# Altium project ange显示键盘.PrjPcb
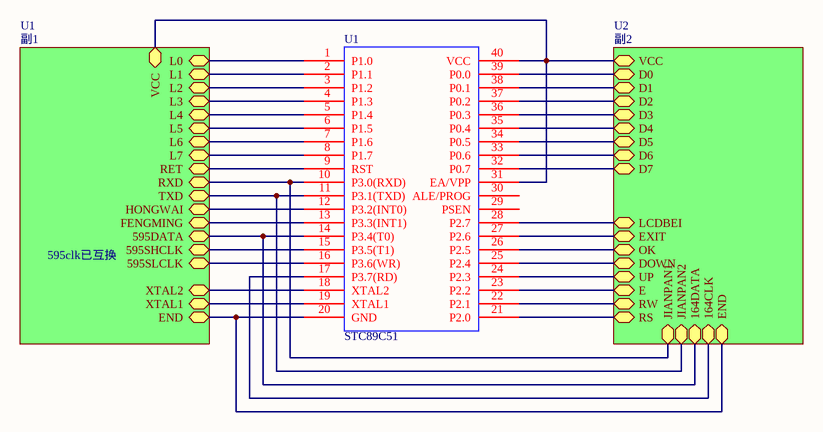
[diagram p0: 主图.SchDoc]
3 sheets, 121 parts. Net scope: hierarchical (ports join the sheet entries above them; power ports are global).
Board file: ANGE.PcbDoc
Sheets:
  主图.SchDoc
    U1 = 副1.SchDoc
    U2 = 副2.SchDoc

## Sheet 主图.SchDoc
size A4

### Parts
U1  STC89C51  [DIP_40]

### Sub-sheets
U1 = 副1: RET, RXD, TXD, HONGWAI, FENGMING, 595DATA, 595SHCLK, 595SLCLK, XTAL2, XTAL1, END, L0, L1, L2, L3, L4, L5, L6, L7, VCC
U2 = 副2: VCC, D0, D1, D2, D3, D4, D5, D6, D7, LCDBEI, EXIT, OK, DOWN, UP, E, RW, RS, JIANPAN1, JIANPAN2, 164DATA, 164CLK, END

### Nets
595SHCLK: U1.16(P3.6(WR)) ; sheet U1/595SLCLK
595SLCLK: U1.15(P3.5(T1)) ; sheet U1/595SHCLK
END: U1.20(GND) ; sheet U1/END, sheet U2/END
VCC: U1.31(EA/VPP) U1.40(VCC) ; sheet U1/VCC, sheet U2/VCC
NetC1_1: U1.18(XTAL2) ; sheet U1/XTAL2
NetC2_1: U1.19(XTAL1) ; sheet U1/XTAL1
NetC4_2: U1.9(RST) ; sheet U1/RET
NetHC1_14: U1.14(P3.4(T0)) ; sheet U1/595DATA, sheet U2/164DATA
NetHC7_8: U1.17(P3.7(RD)) ; sheet U2/164CLK
NetK3_1: U1.27(P2.6) ; sheet U2/EXIT
NetK4_1: U1.24(P2.3) ; sheet U2/UP
NetK5_1: U1.25(P2.4) ; sheet U2/DOWN
NetK6_1: U1.26(P2.5) ; sheet U2/OK
NetK7_1: U1.10(P3.0(RXD)) ; sheet U1/RXD, sheet U2/JIANPAN1
NetK8_1: U1.11(P3.1(TXD)) ; sheet U1/TXD, sheet U2/JIANPAN2
NetR3_1: U1.13(P3.3(INT1)) ; sheet U1/FENGMING
NetR44_1: U1.8(P1.7) ; sheet U1/L7
NetR45_1: U1.7(P1.6) ; sheet U1/L6
NetR46_1: U1.6(P1.5) ; sheet U1/L5
NetR47_1: U1.5(P1.4) ; sheet U1/L4
NetR48_1: U1.4(P1.3) ; sheet U1/L3
NetR49_1: U1.3(P1.2) ; sheet U1/L2
NetR58_1: U1.2(P1.1) ; sheet U1/L1
NetR59_1: U1.1(P1.0) ; sheet U1/L0
NetR60_1: U1.28(P2.7) ; sheet U2/LCDBEI
NetRP1_2: U1.39(P0.0) ; sheet U2/D0
NetRP1_3: U1.38(P0.1) ; sheet U2/D1
NetRP1_4: U1.37(P0.2) ; sheet U2/D2
NetRP1_5: U1.36(P0.3) ; sheet U2/D3
NetRP1_6: U1.35(P0.4) ; sheet U2/D4
NetRP1_7: U1.34(P0.5) ; sheet U2/D5
NetRP1_8: U1.33(P0.6) ; sheet U2/D6
NetRP1_9: U1.32(P0.7) ; sheet U2/D7
NetS1_3: U1.12(P3.2(INT0)) ; sheet U1/HONGWAI
NetU1_21: U1.21(P2.0) ; sheet U2/RS
NetU1_22: U1.22(P2.1) ; sheet U2/RW
NetU1_23: U1.23(P2.2) ; sheet U2/E

Not connected (* = marked no-connect by the designer): U1 29(PSEN) 30(ALE/PROG)

### Notes on the sheet
- 595clk已互换

## Sheet 副1.SchDoc
size A3
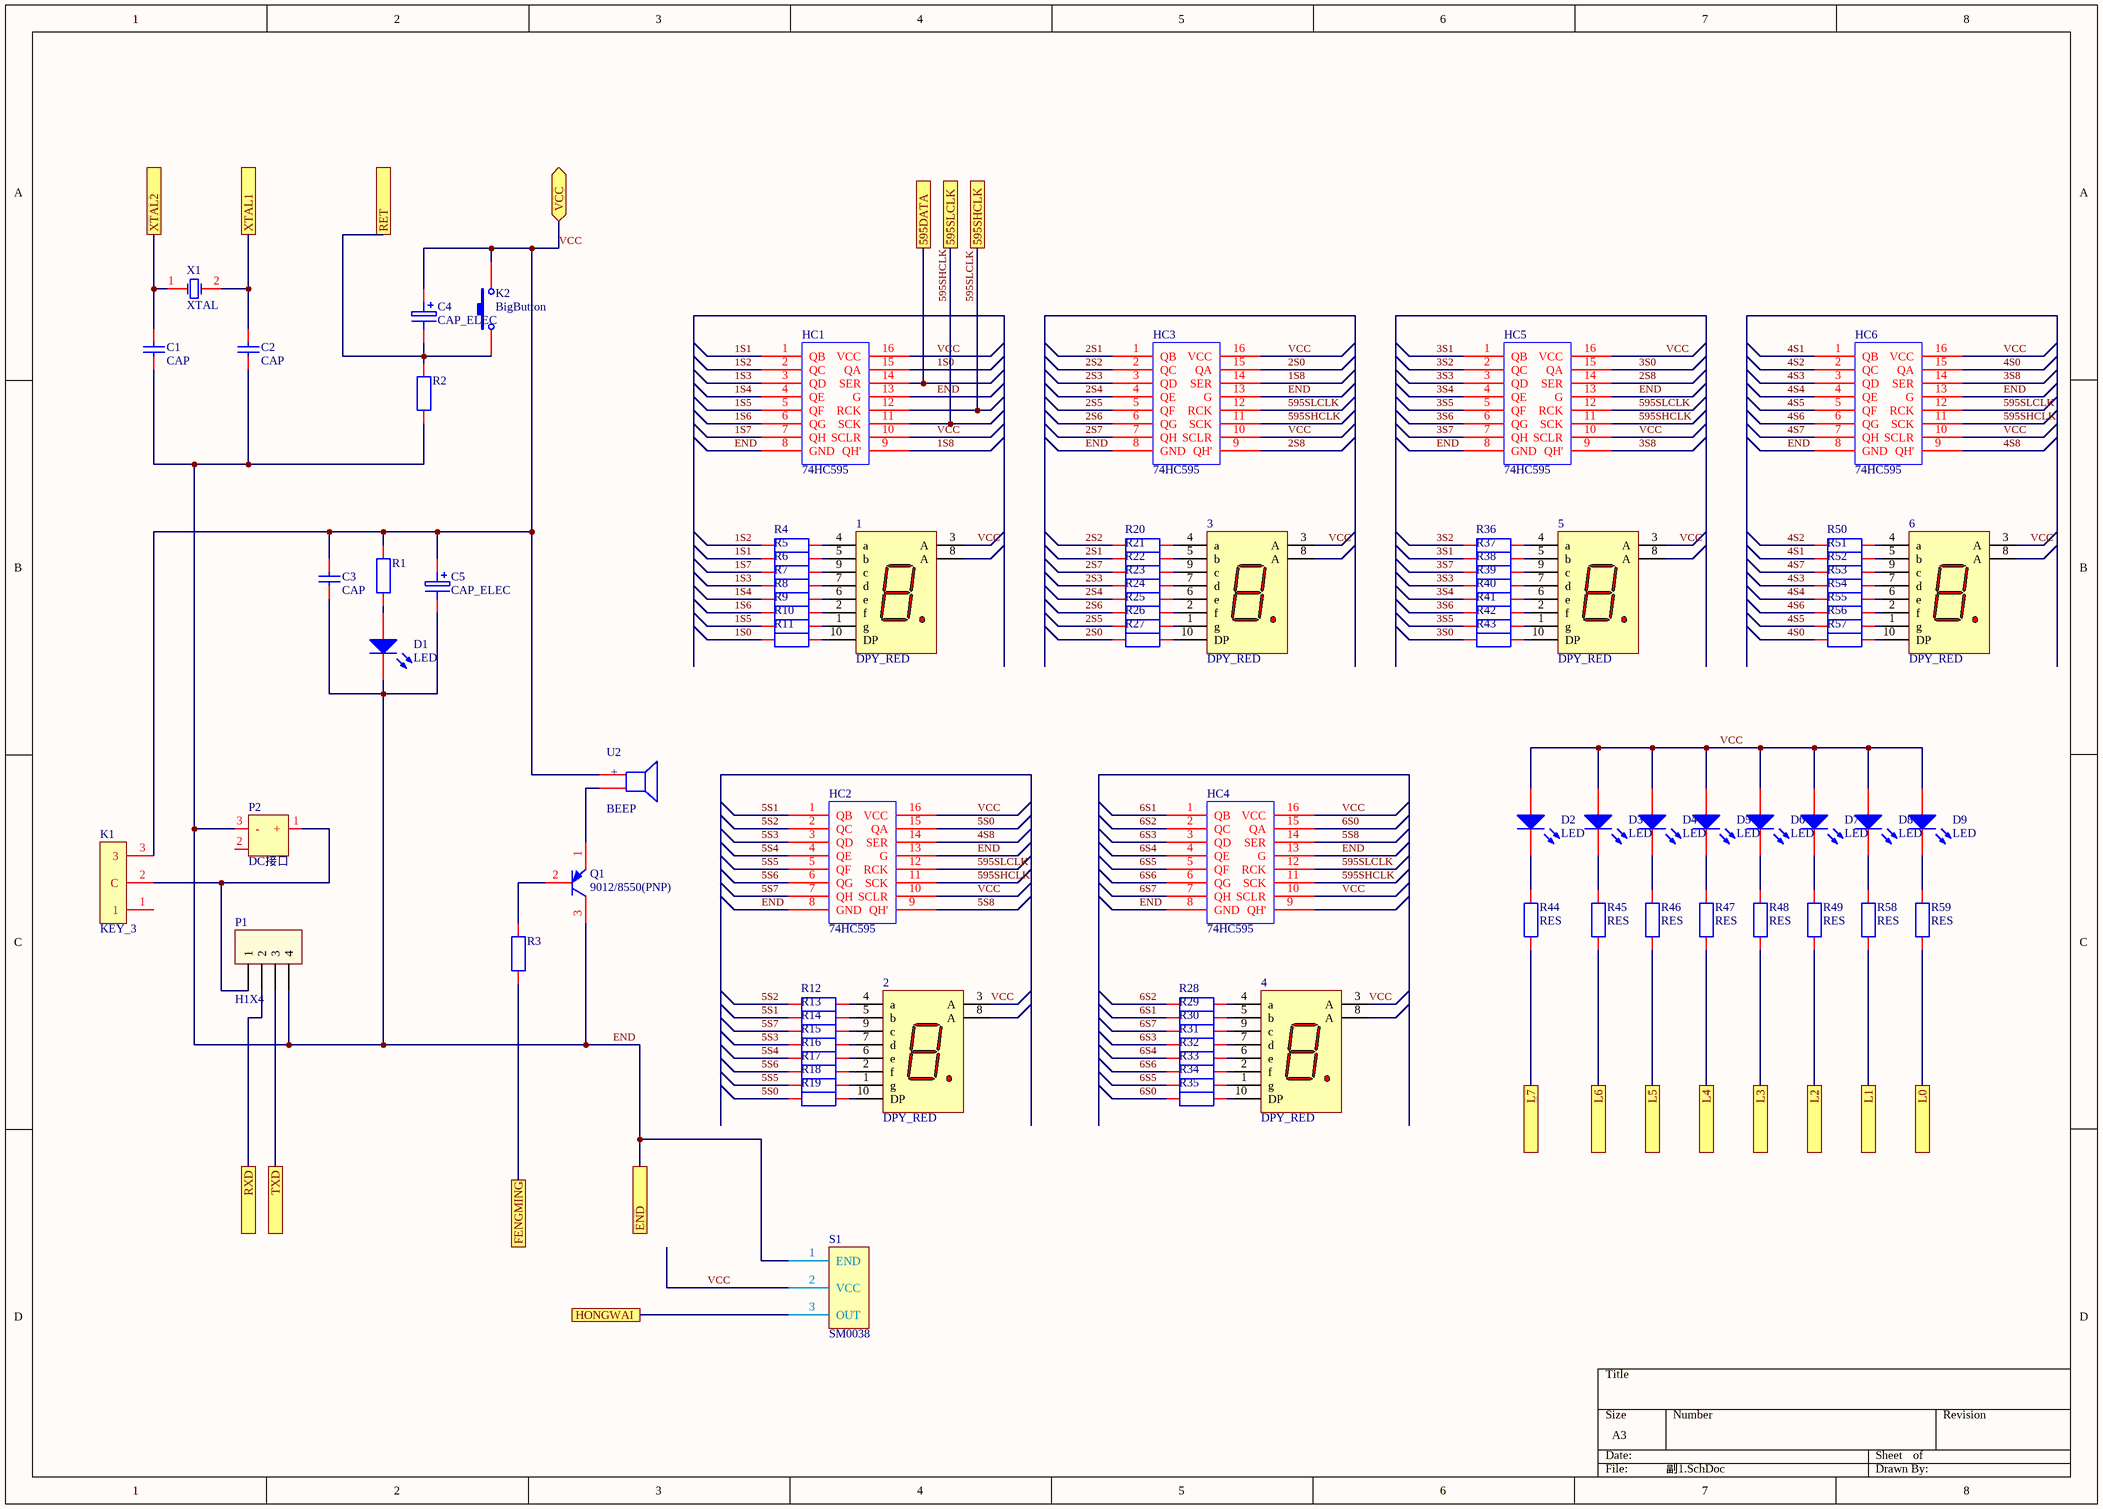
[diagram p1: 副1.SchDoc]

### Parts
1  DPY_RED  [7SEG_8]
2  DPY_RED  [7SEG_8]
3  DPY_RED  [7SEG_8]
4  DPY_RED  [7SEG_8]
5  DPY_RED  [7SEG_8]
6  DPY_RED  [7SEG_8]
C1  CAP  [Cap-Dip]
C2  CAP  [Cap-Dip]
C3  CAP  [Cap-Dip]
C4  CAP_ELEC  [CAP[25V]]
C5  CAP_ELEC  [CAP[16V]]
D1  LED  [LED]
D2  LED  [LED]
D3  LED  [LED]
D4  LED  [LED]
D5  LED  [LED]
D6  LED  [LED]
D7  LED  [LED]
D8  LED  [LED]
D9  LED  [LED]
HC1  74HC595  [DIP_16]
HC2  74HC595  [DIP_16]
HC3  74HC595  [DIP_16]
HC4  74HC595  [DIP_16]
HC5  74HC595  [DIP_16]
HC6  74HC595  [DIP_16]
K1  KEY_3  [KEY_3]
K2  BigButton  [BigButton]
P1  H1X4  [H2.54_1X4]
P2  DC接口  [DC接口]
Q1  9012/8550(PNP)  [TO_92]
R1  RES  [RES_DIP]  (value not drawn)
R2  RES  [RES_DIP]  (value not drawn)
R3  RES  [RES_DIP]  (value not drawn)
R4  RES  [RES_DIP]  (value not drawn)
R5  RES  [RES_DIP]  (value not drawn)
R6  RES  [RES_DIP]  (value not drawn)
R7  RES  [RES_DIP]  (value not drawn)
R8  RES  [RES_DIP]  (value not drawn)
R9  RES  [RES_DIP]  (value not drawn)
R10  RES  [RES_DIP]  (value not drawn)
R11  RES  [RES_DIP]  (value not drawn)
R12  RES  [RES_DIP]  (value not drawn)
R13  RES  [RES_DIP]  (value not drawn)
R14  RES  [RES_DIP]  (value not drawn)
R15  RES  [RES_DIP]  (value not drawn)
R16  RES  [RES_DIP]  (value not drawn)
R17  RES  [RES_DIP]  (value not drawn)
R18  RES  [RES_DIP]  (value not drawn)
R19  RES  [RES_DIP]  (value not drawn)
R20  RES  [RES_DIP]  (value not drawn)
R21  RES  [RES_DIP]  (value not drawn)
R22  RES  [RES_DIP]  (value not drawn)
R23  RES  [RES_DIP]  (value not drawn)
R24  RES  [RES_DIP]  (value not drawn)
R25  RES  [RES_DIP]  (value not drawn)
R26  RES  [RES_DIP]  (value not drawn)
R27  RES  [RES_DIP]  (value not drawn)
R28  RES  [RES_DIP]  (value not drawn)
R29  RES  [RES_DIP]  (value not drawn)
R30  RES  [RES_DIP]  (value not drawn)
R31  RES  [RES_DIP]  (value not drawn)
R32  RES  [RES_DIP]  (value not drawn)
R33  RES  [RES_DIP]  (value not drawn)
R34  RES  [RES_DIP]  (value not drawn)
R35  RES  [RES_DIP]  (value not drawn)
R36  RES  [RES_DIP]  (value not drawn)
R37  RES  [RES_DIP]  (value not drawn)
R38  RES  [RES_DIP]  (value not drawn)
R39  RES  [RES_DIP]  (value not drawn)
R40  RES  [RES_DIP]  (value not drawn)
R41  RES  [RES_DIP]  (value not drawn)
R42  RES  [RES_DIP]  (value not drawn)
R43  RES  [RES_DIP]  (value not drawn)
R44  RES  [RES_DIP]
R45  RES  [RES_DIP]
R46  RES  [RES_DIP]
R47  RES  [RES_DIP]
R48  RES  [RES_DIP]
R49  RES  [RES_DIP]
R50  RES  [RES_DIP]  (value not drawn)
R51  RES  [RES_DIP]  (value not drawn)
R52  RES  [RES_DIP]  (value not drawn)
R53  RES  [RES_DIP]  (value not drawn)
R54  RES  [RES_DIP]  (value not drawn)
R55  RES  [RES_DIP]  (value not drawn)
R56  RES  [RES_DIP]  (value not drawn)
R57  RES  [RES_DIP]  (value not drawn)
R58  RES  [RES_DIP]
R59  RES  [RES_DIP]
S1  SM0038  [SM0038]
U2  BEEP  [BEEP]
X1  XTAL  [XTAL_DIP]

### Ports
595DATA, 595SHCLK, 595SLCLK, END, FENGMING, HONGWAI, L0, L1, L2, L3, L4, L5, L6, L7, RET, RXD, TXD, VCC, XTAL1, XTAL2

### Nets
1S0: HC1.15(QA) R11.1
1S1: HC1.1(QB) R5.1
1S2: HC1.2(QC) R4.1
1S3: HC1.3(QD) R7.1
1S4: HC1.4(QE) R8.1
1S5: HC1.5(QF) R10.1
1S6: HC1.6(QG) R9.1
1S7: HC1.7(QH) R6.1
1S8: HC1.9(QH') HC3.14(SER)
2S0: HC3.15(QA) R27.1
2S1: HC3.1(QB) R21.1
2S2: HC3.2(QC) R20.1
2S3: HC3.3(QD) R23.1
2S4: HC3.4(QE) R24.1
2S5: HC3.5(QF) R26.1
2S6: HC3.6(QG) R25.1
2S7: HC3.7(QH) R22.1
2S8: HC3.9(QH') HC5.14(SER)
3S0: HC5.15(QA) R43.1
3S1: HC5.1(QB) R37.1
3S2: HC5.2(QC) R36.1
3S3: HC5.3(QD) R39.1
3S4: HC5.4(QE) R40.1
3S5: HC5.5(QF) R42.1
3S6: HC5.6(QG) R41.1
3S7: HC5.7(QH) R38.1
3S8: HC5.9(QH') HC6.14(SER)
4S0: HC6.15(QA) R57.1
4S1: HC6.1(QB) R51.1
4S2: HC6.2(QC) R50.1
4S3: HC6.3(QD) R53.1
4S4: HC6.4(QE) R54.1
4S5: HC6.5(QF) R56.1
4S6: HC6.6(QG) R55.1
4S7: HC6.7(QH) R52.1
4S8: HC2.14(SER) HC6.9(QH')
5S0: HC2.15(QA) R19.1
5S1: HC2.1(QB) R13.1
5S2: HC2.2(QC) R12.1
5S3: HC2.3(QD) R15.1
5S4: HC2.4(QE) R16.1
5S5: HC2.5(QF) R18.1
5S6: HC2.6(QG) R17.1
5S7: HC2.7(QH) R14.1
5S8: HC2.9(QH') HC4.14(SER)
6S0: HC4.15(QA) R35.1
6S1: HC4.1(QB) R29.1
6S2: HC4.2(QC) R28.1
6S3: HC4.3(QD) R31.1
6S4: HC4.4(QE) R32.1
6S5: HC4.5(QF) R34.1
6S6: HC4.6(QG) R33.1
6S7: HC4.7(QH) R30.1
595SHCLK: HC1.11(SCK) HC2.11(SCK) HC3.11(SCK) HC4.11(SCK) HC5.11(SCK) HC6.11(SCK) ; port 595SLCLK
595SLCLK: HC1.12(RCK) HC2.12(RCK) HC3.12(RCK) HC4.12(RCK) HC5.12(RCK) HC6.12(RCK) ; port 595SHCLK
END: C1.2 C2.2 C3.2 C5.2 D1.2(K) HC1.8(GND) HC1.13(G) HC2.8(GND) HC2.13(G) HC3.8(GND) HC3.13(G) HC4.8(GND) HC4.13(G) HC5.8(GND) HC5.13(G) HC6.8(GND) HC6.13(G) P1.4 P2.3(-) Q1.3(C) R2.1 S1.1(END) ; port END
VCC: 1.3(A) 2.3(A) 3.3(A) 4.3(A) 5.3(A) 6.3(A) C3.1 C4.1 C5.1 D2.1(A) D3.1(A) D4.1(A) D5.1(A) D6.1(A) D7.1(A) D8.1(A) D9.1(A) HC1.10(SCLR) HC1.16(VCC) HC2.10(SCLR) HC2.16(VCC) HC3.10(SCLR) HC3.16(VCC) HC4.10(SCLR) HC4.16(VCC) HC5.10(SCLR) HC5.16(VCC) HC6.10(SCLR) HC6.16(VCC) K1.3 K2.2 R1.2 S1.2(VCC) U2.1 ; port VCC
Net1_1: 1.1(g) R10.2
Net1_2: 1.2(f) R9.2
Net1_4: 1.4(a) R4.2
Net1_5: 1.5(b) R5.2
Net1_6: 1.6(e) R8.2
Net1_7: 1.7(d) R7.2
Net1_9: 1.9(c) R6.2
Net1_10: 1.10(DP) R11.2
Net2_1: 2.1(g) R18.2
Net2_2: 2.2(f) R17.2
Net2_4: 2.4(a) R12.2
Net2_5: 2.5(b) R13.2
Net2_6: 2.6(e) R16.2
Net2_7: 2.7(d) R15.2
Net2_9: 2.9(c) R14.2
Net2_10: 2.10(DP) R19.2
Net3_1: 3.1(g) R26.2
Net3_2: 3.2(f) R25.2
Net3_4: 3.4(a) R20.2
Net3_5: 3.5(b) R21.2
Net3_6: 3.6(e) R24.2
Net3_7: 3.7(d) R23.2
Net3_9: 3.9(c) R22.2
Net3_10: 3.10(DP) R27.2
Net4_1: 4.1(g) R34.2
Net4_2: 4.2(f) R33.2
Net4_4: 4.4(a) R28.2
Net4_5: 4.5(b) R29.2
Net4_6: 4.6(e) R32.2
Net4_7: 4.7(d) R31.2
Net4_9: 4.9(c) R30.2
Net4_10: 4.10(DP) R35.2
Net5_1: 5.1(g) R42.2
Net5_2: 5.2(f) R41.2
Net5_4: 5.4(a) R36.2
Net5_5: 5.5(b) R37.2
Net5_6: 5.6(e) R40.2
Net5_7: 5.7(d) R39.2
Net5_9: 5.9(c) R38.2
Net5_10: 5.10(DP) R43.2
Net6_1: 6.1(g) R56.2
Net6_2: 6.2(f) R55.2
Net6_4: 6.4(a) R50.2
Net6_5: 6.5(b) R51.2
Net6_6: 6.6(e) R54.2
Net6_7: 6.7(d) R53.2
Net6_9: 6.9(c) R52.2
Net6_10: 6.10(DP) R57.2
NetC1_1: C1.1 X1.1(OSC1) ; port XTAL2
NetC2_1: C2.1 X1.2(OSC2) ; port XTAL1
NetC4_2: C4.2 K2.1 R2.2 ; port RET
NetD1_1: D1.1(A) R1.1
NetD2_2: D2.2(K) R44.2
NetD3_2: D3.2(K) R45.2
NetD4_2: D4.2(K) R46.2
NetD5_2: D5.2(K) R47.2
NetD6_2: D6.2(K) R48.2
NetD7_2: D7.2(K) R49.2
NetD8_2: D8.2(K) R58.2
NetD9_2: D9.2(K) R59.2
NetHC1_14: HC1.14(SER) ; port 595DATA
NetK1_2: K1.2(C) P1.1 P2.1(+)
NetK7_1: P1.2 ; port RXD
NetK8_1: P1.3 ; port TXD
NetQ1_1: Q1.1(E) U2.2
NetQ1_2: Q1.2(B) R3.2
NetR3_1: R3.1 ; port FENGMING
NetR44_1: R44.1 ; port L7
NetR45_1: R45.1 ; port L6
NetR46_1: R46.1 ; port L5
NetR47_1: R47.1 ; port L4
NetR48_1: R48.1 ; port L3
NetR49_1: R49.1 ; port L2
NetR58_1: R58.1 ; port L1
NetR59_1: R59.1 ; port L0
NetS1_3: S1.3(OUT) ; port HONGWAI

Not connected (* = marked no-connect by the designer): 1 8(A); 2 8(A); 3 8(A); 4 8(A); 5 8(A); 6 8(A); HC4 9(QH'); K1 1; P2 2

### Notes on the sheet
- (in symbol BEEP) +

### Library data of the parts
K1 = KEY_3: 乒乓开关
P2 = DC接口: 电源接口
Q1 = 9012/8550(PNP): PNP

## Sheet 副2.SchDoc
size A3
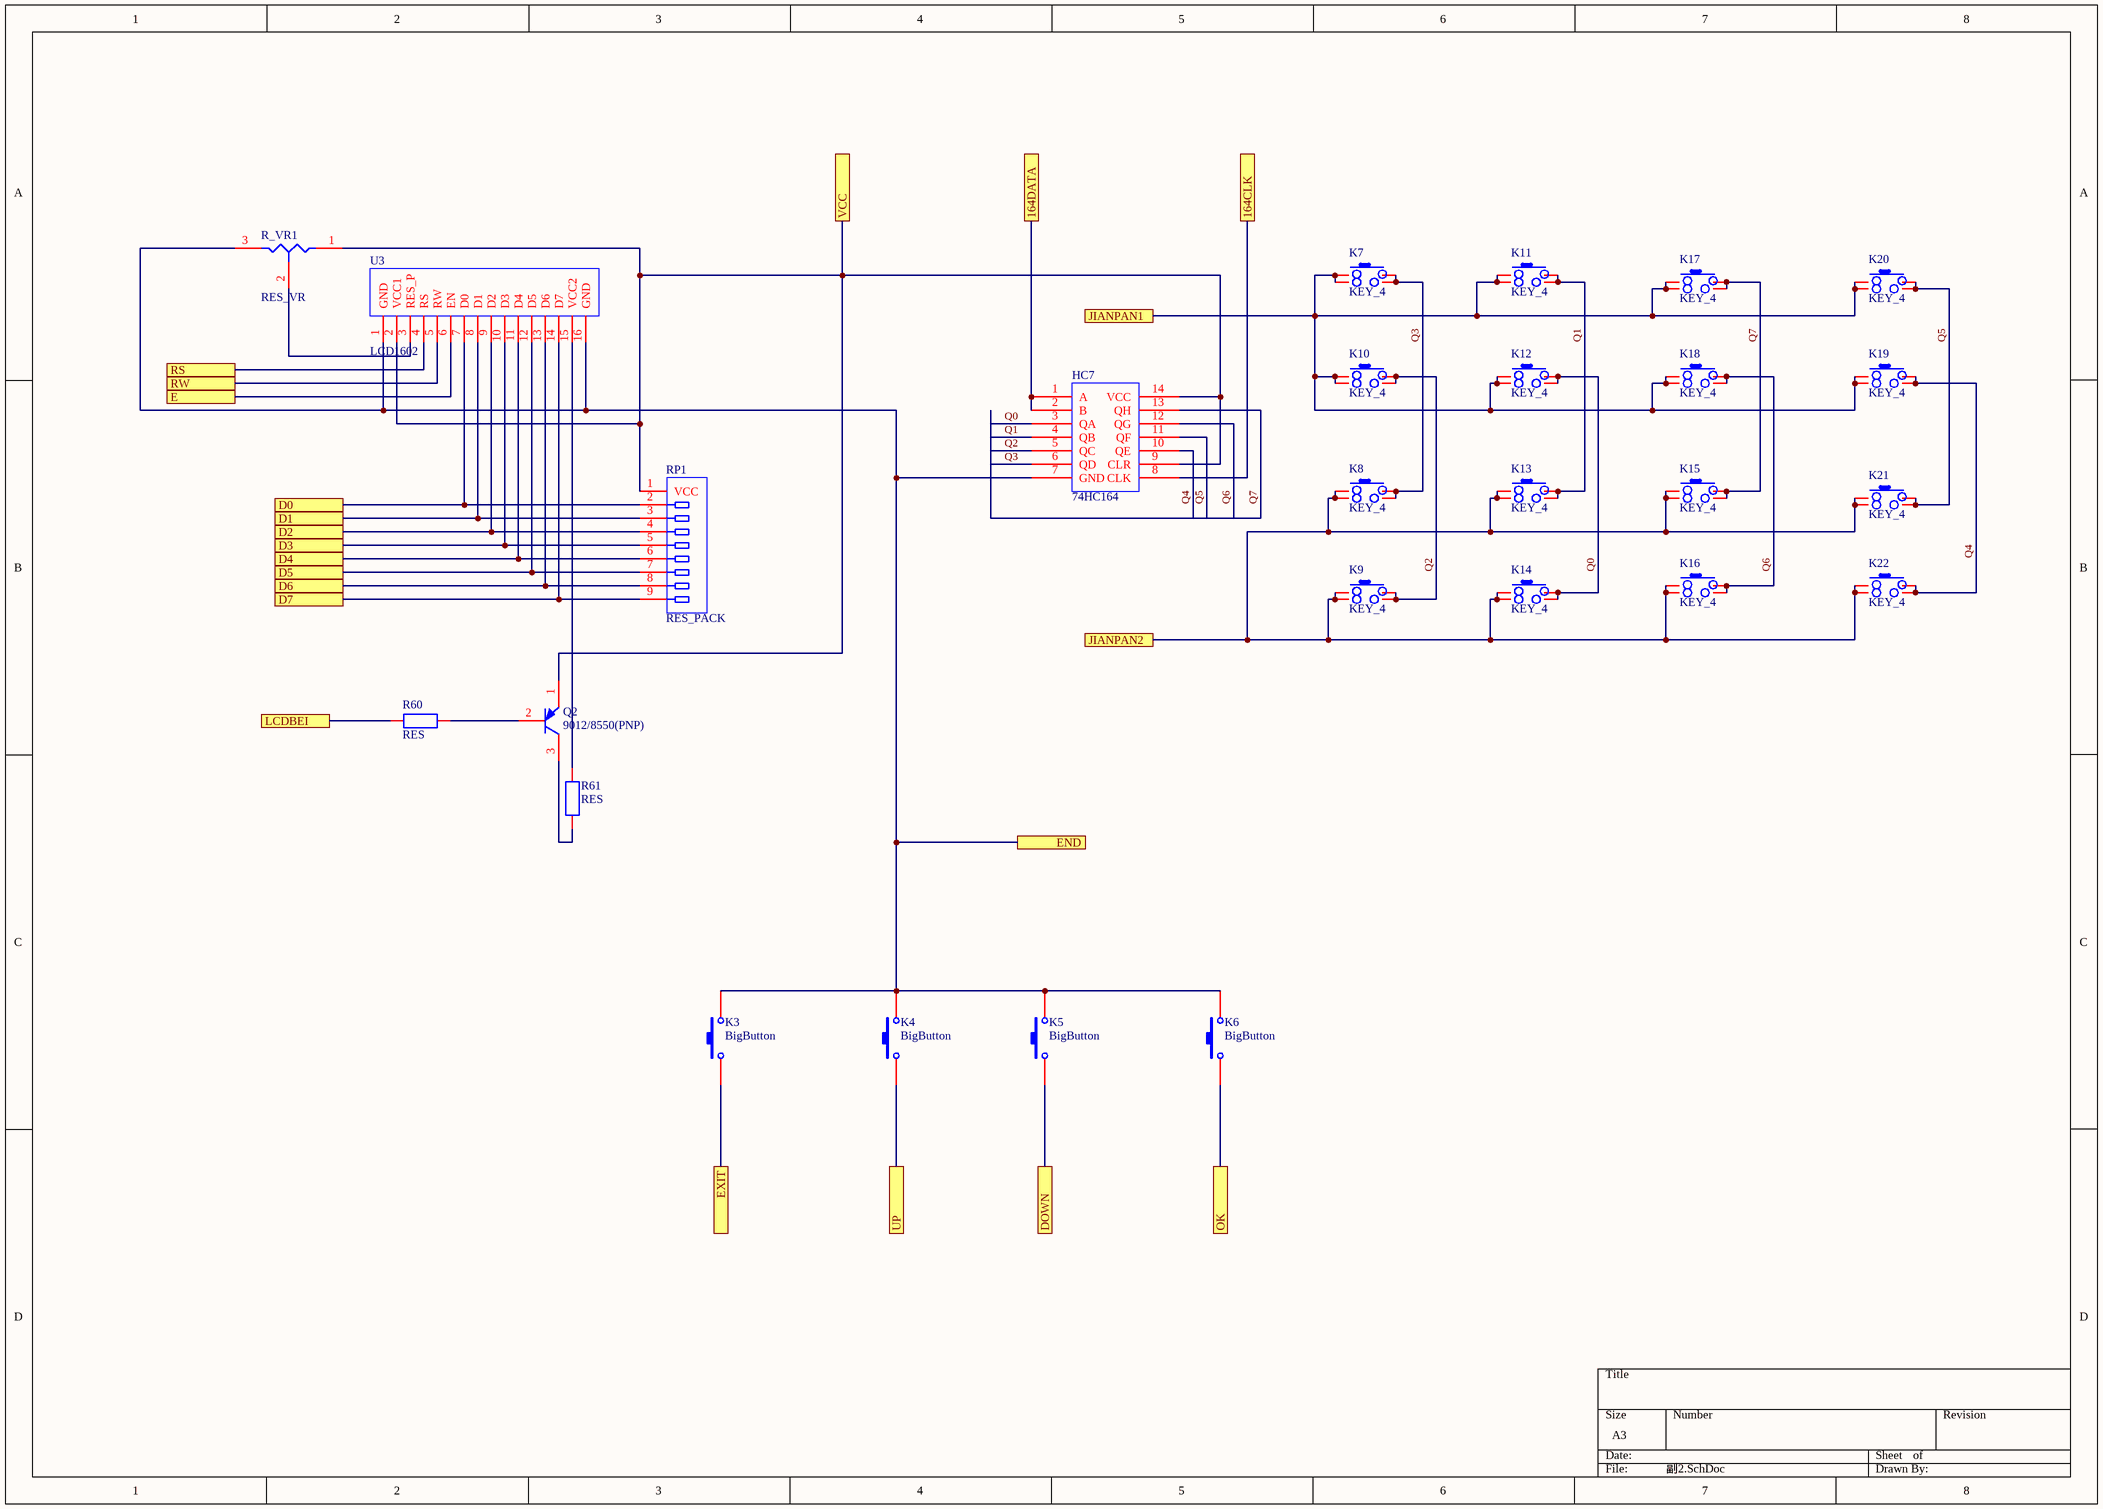
[diagram p2: 副2.SchDoc]

### Parts
HC7  74HC164  [DIP_14]
K3  BigButton  [BigButton]
K4  BigButton  [BigButton]
K5  BigButton  [BigButton]
K6  BigButton  [BigButton]
K7  KEY_4  [KEY_4]
K8  KEY_4  [KEY_4]
K9  KEY_4  [KEY_4]
K10  KEY_4  [KEY_4]
K11  KEY_4  [KEY_4]
K12  KEY_4  [KEY_4]
K13  KEY_4  [KEY_4]
K14  KEY_4  [KEY_4]
K15  KEY_4  [KEY_4]
K16  KEY_4  [KEY_4]
K17  KEY_4  [KEY_4]
K18  KEY_4  [KEY_4]
K19  KEY_4  [KEY_4]
K20  KEY_4  [KEY_4]
K21  KEY_4  [KEY_4]
K22  KEY_4  [KEY_4]
Q2  9012/8550(PNP)  [TO_92]
R60  RES  [RES_DIP]
R61  RES  [RES_DIP]
R_VR1  RES_VR  [RES_VR3296W]
RP1  RES_PACK  [RES_PACK]
U3  LCD1602  [LCD1602]

### Ports
164CLK, 164DATA, D0, D1, D2, D3, D4, D5, D6, D7, DOWN, E, END, EXIT, JIANPAN1, JIANPAN2, LCDBEI, OK, RS, RW, UP, VCC

### Nets
END: HC7.7(GND) K3.2 K4.2 K5.2 K6.2 R_VR1.3 U3.1(GND) U3.16(GND) ; port END
Q0: HC7.3(QA) K12.3 K12.4 K14.3 K14.4
Q1: HC7.4(QB) K11.3 K11.4 K13.3 K13.4
Q2: HC7.5(QC) K9.3 K9.4 K10.3 K10.4
Q3: HC7.6(QD) K7.3 K7.4 K8.3 K8.4
Q4: HC7.10(QE) K19.3 K19.4 K22.3 K22.4
Q5: HC7.11(QF) K20.3 K20.4 K21.3 K21.4
Q6: HC7.12(QG) K16.3 K16.4 K18.3 K18.4
Q7: HC7.13(QH) K15.3 K15.4 K17.3 K17.4
VCC: HC7.9(CLR) HC7.14(VCC) Q2.1(E) R_VR1.1 RP1.1(VCC) U3.2(VCC1) ; port VCC
NetHC1_14: HC7.1(A) HC7.2(B) ; port 164DATA
NetHC7_8: HC7.8(CLK) ; port 164CLK
NetK3_1: K3.1 ; port EXIT
NetK4_1: K4.1 ; port UP
NetK5_1: K5.1 ; port DOWN
NetK6_1: K6.1 ; port OK
NetK7_1: K7.1 K7.2 K10.1 K10.2 K11.1 K11.2 K12.1 K12.2 K17.1 K17.2 K18.1 K18.2 K19.1 K19.2 K20.1 K20.2 ; port JIANPAN1
NetK8_1: K8.1 K8.2 K9.1 K9.2 K13.1 K13.2 K14.1 K14.2 K15.1 K15.2 K16.1 K16.2 K21.1 K21.2 K22.1 K22.2 ; port JIANPAN2
NetQ2_2: Q2.2(B) R60.2
NetQ2_3: Q2.3(C) R61.2
NetR60_1: R60.1 ; port LCDBEI
NetR61_1: R61.1 U3.15(VCC2)
NetR_VR1_2: R_VR1.2 U3.3(RES_P)
NetRP1_2: RP1.2 U3.7(D0) ; port D0
NetRP1_3: RP1.3 U3.8(D1) ; port D1
NetRP1_4: RP1.4 U3.9(D2) ; port D2
NetRP1_5: RP1.5 U3.10(D3) ; port D3
NetRP1_6: RP1.6 U3.11(D4) ; port D4
NetRP1_7: RP1.7 U3.12(D5) ; port D5
NetRP1_8: RP1.8 U3.13(D6) ; port D6
NetRP1_9: RP1.9 U3.14(D7) ; port D7
NetU1_21: U3.4(RS) ; port RS
NetU1_22: U3.5(RW) ; port RW
NetU1_23: U3.6(EN) ; port E

### Library data of the parts
Q2 = 9012/8550(PNP): PNP
R_VR1 = RES_VR: 滑动变阻器

## Nets that join several sheets
595SHCLK: 主图 (U1.16), 副1 (6 pins)
595SLCLK: 主图 (U1.15), 副1 (6 pins)
END: 主图 (U1.20), 副1 (22 pins), 副2 (8 pins)
NetC1_1: 主图 (U1.18), 副1 (C1.1 X1.1)
NetC2_1: 主图 (U1.19), 副1 (C2.1 X1.2)
NetC4_2: 主图 (U1.9), 副1 (C4.2 K2.1 R2.2)
NetHC1_14: 主图 (U1.14), 副1 (HC1.14), 副2 (HC7.1 HC7.2)
NetHC7_8: 主图 (U1.17), 副2 (HC7.8)
NetK3_1: 主图 (U1.27), 副2 (K3.1)
NetK4_1: 主图 (U1.24), 副2 (K4.1)
NetK5_1: 主图 (U1.25), 副2 (K5.1)
NetK6_1: 主图 (U1.26), 副2 (K6.1)
NetK7_1: 主图 (U1.10), 副1 (P1.2), 副2 (16 pins)
NetK8_1: 主图 (U1.11), 副1 (P1.3), 副2 (16 pins)
NetR3_1: 主图 (U1.13), 副1 (R3.1)
NetR44_1: 主图 (U1.8), 副1 (R44.1)
NetR45_1: 主图 (U1.7), 副1 (R45.1)
NetR46_1: 主图 (U1.6), 副1 (R46.1)
NetR47_1: 主图 (U1.5), 副1 (R47.1)
NetR48_1: 主图 (U1.4), 副1 (R48.1)
NetR49_1: 主图 (U1.3), 副1 (R49.1)
NetR58_1: 主图 (U1.2), 副1 (R58.1)
NetR59_1: 主图 (U1.1), 副1 (R59.1)
NetR60_1: 主图 (U1.28), 副2 (R60.1)
NetRP1_2: 主图 (U1.39), 副2 (RP1.2 U3.7)
NetRP1_3: 主图 (U1.38), 副2 (RP1.3 U3.8)
NetRP1_4: 主图 (U1.37), 副2 (RP1.4 U3.9)
NetRP1_5: 主图 (U1.36), 副2 (RP1.5 U3.10)
NetRP1_6: 主图 (U1.35), 副2 (RP1.6 U3.11)
NetRP1_7: 主图 (U1.34), 副2 (RP1.7 U3.12)
NetRP1_8: 主图 (U1.33), 副2 (RP1.8 U3.13)
NetRP1_9: 主图 (U1.32), 副2 (RP1.9 U3.14)
NetS1_3: 主图 (U1.12), 副1 (S1.3)
NetU1_21: 主图 (U1.21), 副2 (U3.4)
NetU1_22: 主图 (U1.22), 副2 (U3.5)
NetU1_23: 主图 (U1.23), 副2 (U3.6)
VCC: 主图 (U1.31 U1.40), 副1 (34 pins), 副2 (6 pins)